# Altium schematic sheet Crystal.SchDoc
size A4; SheetNumber: 4; SheetTotal: 4
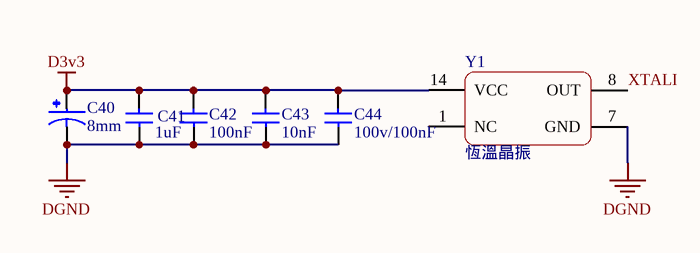
[diagram p0: Crystal.SchDoc]

## Parts
C40  8mm  [CAP_dual]
C41  1uF  [C-0603]
C42  100nF  [C-0603]
C43  10nF  [C-0603]
C44  100v/100nF  [100v0.1u]
Y1  恆溫晶振  [恆溫晶振]

## Nets
D3v3: C40.1 C41.2 C42.2 C43.2 C44.2 Y1.14(VCC)
DGND: C40.2 C41.1 C42.1 C43.1 C44.1 Y1.7(GND)
XTALI: Y1.8(OUT)

Not connected (* = marked no-connect by the designer): Y1 1(NC)

## Library data of the parts
C40 = dip-cap: 8mm cap
C41-C43 = C-0603
C44 = plastic cap: plastic capacitor